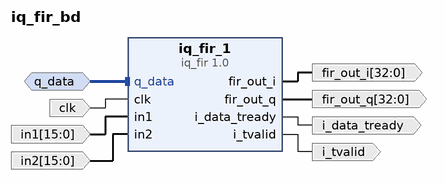
[diagram p0: block diagram of the top level]
# Vivado block design iq_fir_bd, xc7s50csga324-2, Vivado 2018.3
create_bd_design iq_fir_bd

create_bd_intf_port -mode Slave -vlnv xilinx.com:interface:axis_rtl:1.0 q_data
set_property -dict [list \
  CONFIG.HAS_TKEEP 0 \
  CONFIG.HAS_TLAST 0 \
  CONFIG.HAS_TREADY 1 \
  CONFIG.HAS_TSTRB 0 \
  CONFIG.LAYERED_METADATA undef \
  CONFIG.TDATA_NUM_BYTES 0 \
  CONFIG.TDEST_WIDTH 0 \
  CONFIG.TID_WIDTH 0 \
  CONFIG.TUSER_WIDTH 0 \
] [get_bd_intf_ports q_data]
create_bd_port -dir I -type clk clk
create_bd_port -dir O -from 32 -to 0 -type data fir_out_i
create_bd_port -dir O -from 32 -to 0 -type data fir_out_q
create_bd_port -dir O -type data i_data_tready
create_bd_port -dir O -type data i_tvalid
create_bd_port -dir I -from 15 -to 0 -type data in1
create_bd_port -dir I -from 15 -to 0 -type data in2

create_bd_cell -type ip -vlnv User_Company:SysGen:iq_fir:1.0 iq_fir_1

# ---- connections ----

connect_bd_intf_net [get_bd_intf_ports q_data] [get_bd_intf_pins iq_fir_1/q_data]
connect_bd_net [get_bd_ports clk] [get_bd_pins iq_fir_1/clk]
connect_bd_net [get_bd_pins iq_fir_1/fir_out_i] [get_bd_ports fir_out_i]
connect_bd_net [get_bd_pins iq_fir_1/fir_out_q] [get_bd_ports fir_out_q]
connect_bd_net [get_bd_pins iq_fir_1/i_data_tready] [get_bd_ports i_data_tready]
connect_bd_net [get_bd_pins iq_fir_1/i_tvalid] [get_bd_ports i_tvalid]
connect_bd_net -net in1_1 [get_bd_ports in1] [get_bd_pins iq_fir_1/in1]
connect_bd_net -net in2_1 [get_bd_ports in2] [get_bd_pins iq_fir_1/in2]

validate_bd_design
save_bd_design
